# Altium schematic sheet HTBLEBMSALL4G&AB_Sch_V0.1_20260317.SchDoc
size A3; SheetNumber: 3; SheetTotal: 3
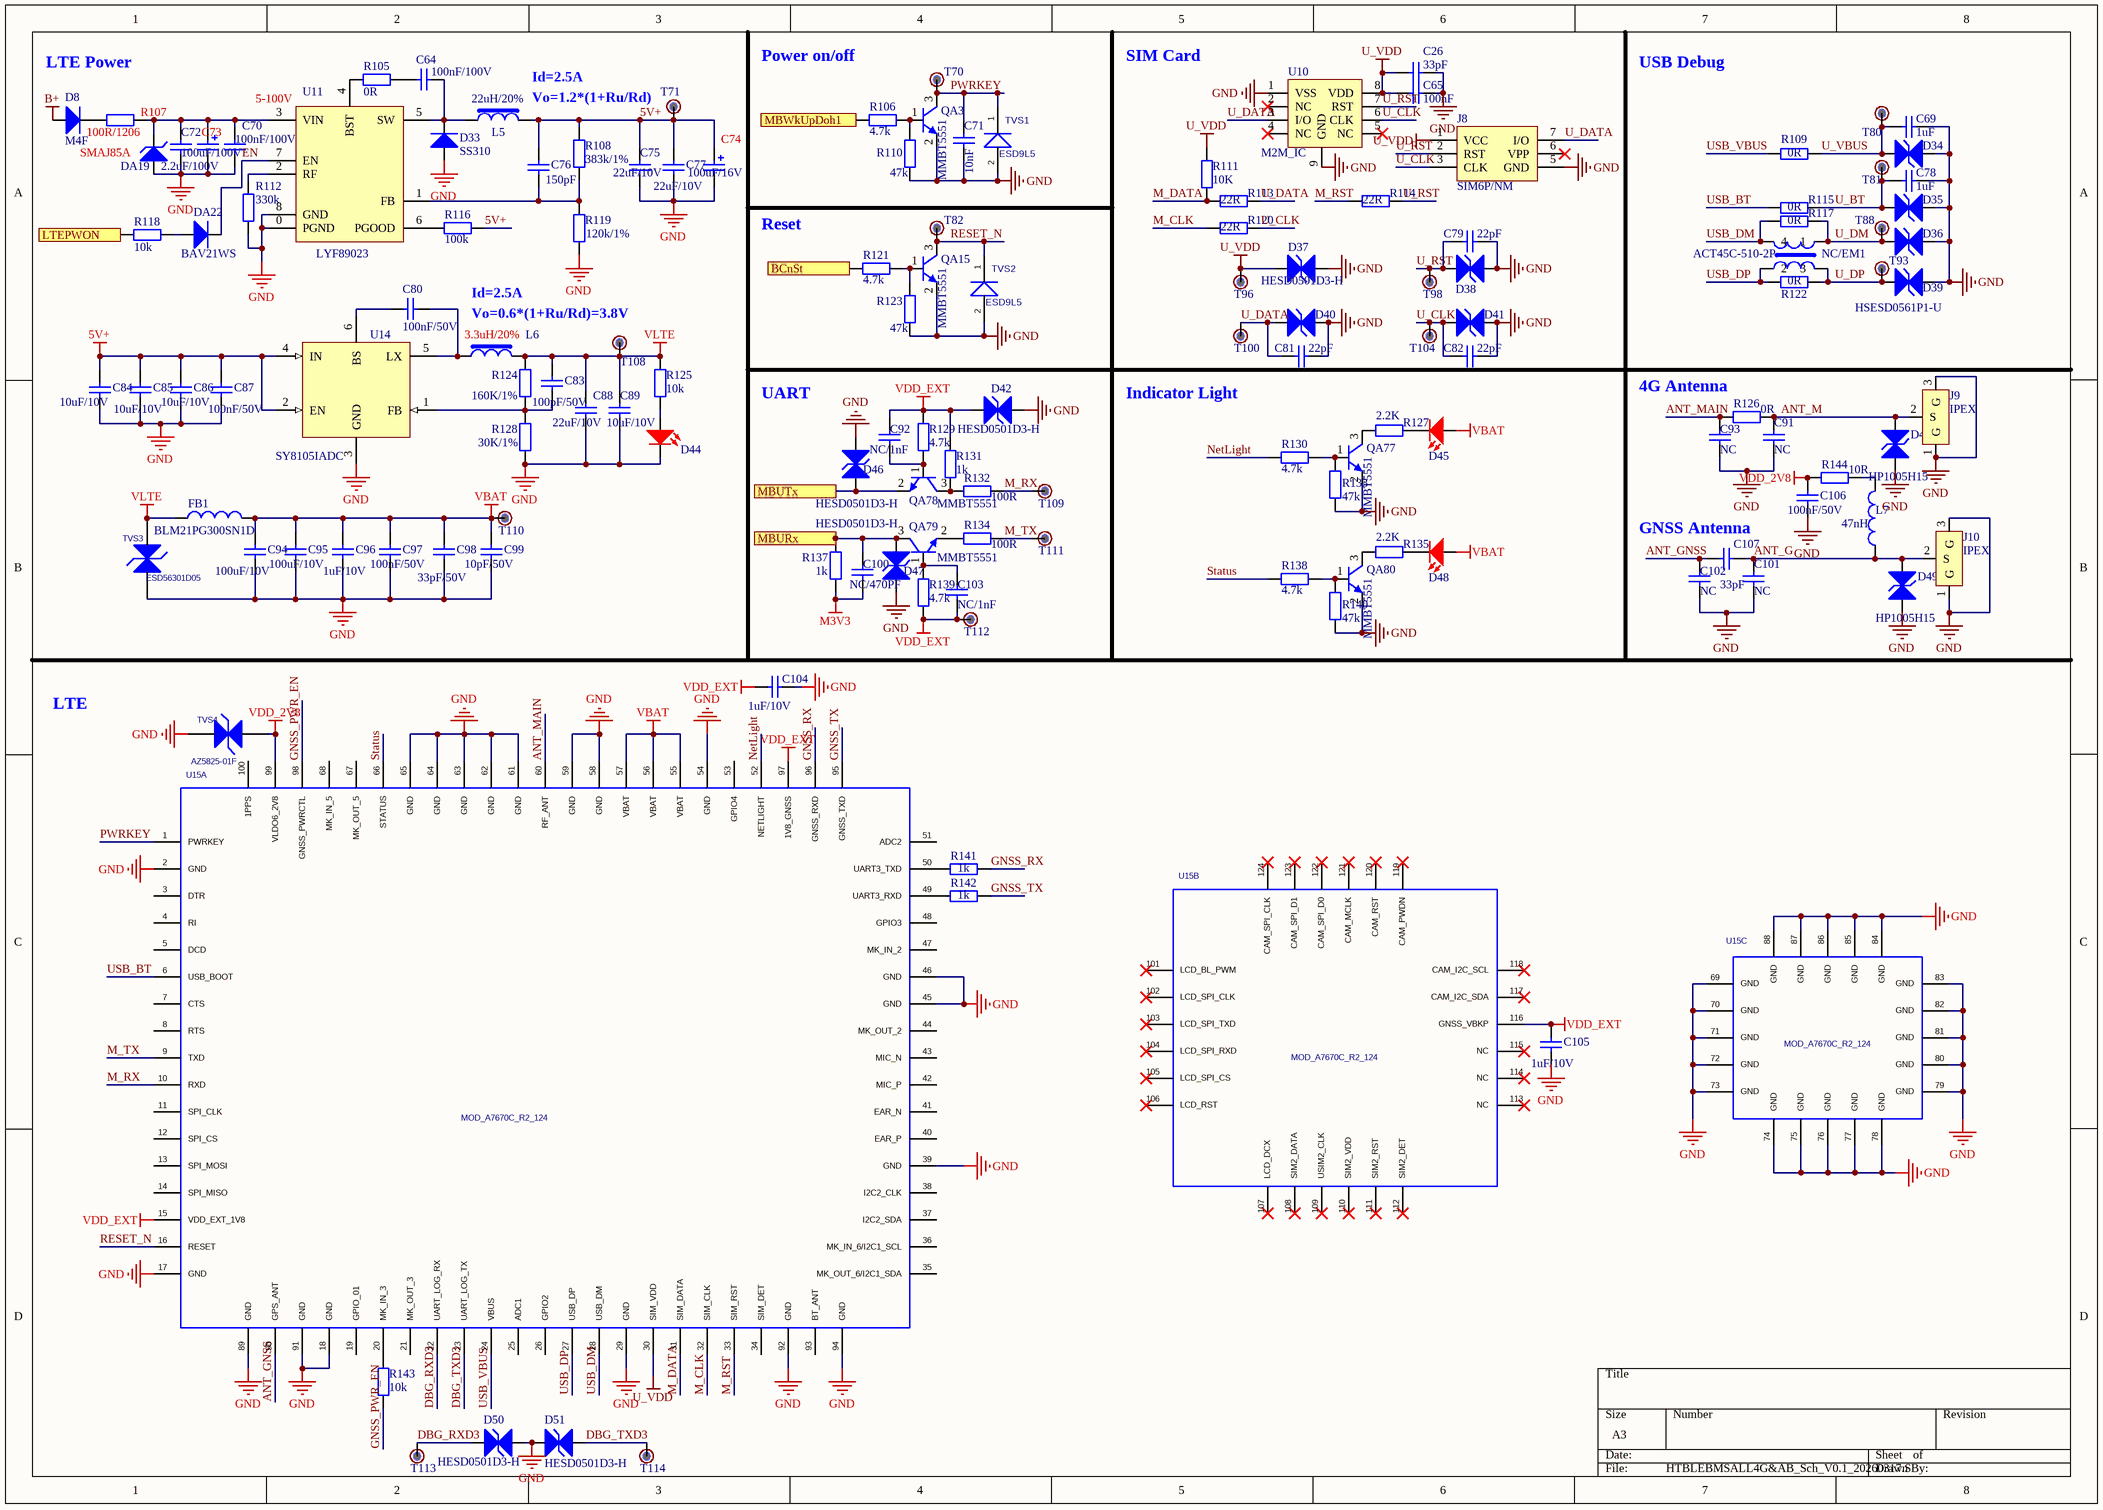
[diagram p0: HTBLEBMSALL4G&AB_Sch_V0.1_20260317.SchDoc]

## Parts
C26  33pF  [C0603]
C64  100nF/100V  [C0603]
C65  100nF  [C0603]
C69  1uF  [C0603]
C70  100nF/100V  [C0603]
C71  10nF  [C0603]
C72  2.2uF/100V  [C1206]
C73  value 100uF/100V  [CAP-SMD_BD12.5-L13.0-100UF100V]  (hidden comment: Cap Pol2)
C74  value 100uF/16V  [CAP-SMD_BD6.3-L5.7_100UF/16V]  (hidden comment: Cap Pol2)
C75  22uF/10V  [C0603]
C76  150pF  [C0603]
C77  22uF/10V  [C0603]
C78  1uF  [C0603]
C79  22pF  [C0603]
C80  100nF/50V  [C0603]
C81  22pF  [C0603]
C82  22pF  [C0603]
C83  100pF/50V  [C0603]
C84  10uF/10V  [C0603]
C85  10uF/10V  [C0603]
C86  10uF/10V  [C0603]
C87  100nF/50V  [C0603]
C88  22uF/10V  [C0603]
C89  10uF/10V  [C0603]
C91  NC  [C0603]
C92  NC/1nF  [C0603]
C93  NC  [C0603]
C94  100uF/10V  [C1206]
C95  100uF/10V  [C1206]
C96  1uF/10V  [C0603]
C97  100nF/50V  [C0603]
C98  33pF/50V  [C0603]
C99  10pF/50V  [C0603]
C100  NC/470PF  [C0603]
C101  NC  [C0603]
C102  NC  [C0603]
C103  NC/1nF  [C0603]
C104  1uF/10V  [C0603]
C105  1uF/10V  [C0603]
C106  100nF/50V  [C0603]
C107  33pF  [C0603]
D8  M4F  [SMAF/DO-214AD]
D33  SS310  [SMA/DO-214AC]
D34  HSESD0561P1-U  [SOD-323]  (value not drawn)
D35  HSESD0561P1-U  [SOD-323]  (value not drawn)
D36  HSESD0561P1-U  [SOD-323]  (value not drawn)
D37  HESD0501D3-H  [SOD-323]
D38  HESD0501D3-H  [SOD-323]  (value not drawn)
D39  HSESD0561P1-U  [SOD-323]
D40  HESD0501D3-H  [SOD-323]  (value not drawn)
D41  HESD0501D3-H  [SOD-323]  (value not drawn)
D42  HESD0501D3-H  [SOD-323]
D43  HP1005H15  [HP1005H15]
D44  XL-1608SURC-06/XL-1608UBC-04  [LED0603R]  (value not drawn)
D45  XL-1608SURC-06/XL-1608UBC-04  [LED0603R]  (value not drawn)
D46  HESD0501D3-H  [SOD-323]
D47  HESD0501D3-H  [SOD-323]
D48  XL-1608SURC-06/XL-1608UBC-04  [LED0603R]  (value not drawn)
D49  HP1005H15  [HP1005H15]
D50  HESD0501D3-H  [SOD-323]
D51  HESD0501D3-H  [SOD-323]
DA19  SMAJ85A  [SMA/DO-214AC]
DA22  BAV21WS  [SOD-323]
FB1  BLM21PG300SN1D  [0805]
J8  SIM6P/NM  [SIM6P]
J9  IPEX  [IPEX]
J10  IPEX  [IPEX]
L5  22uH/20%  [FXL0630-220]
L6  3.3uH/20%  [L4.0x4.0mm]
L7  47nH  [0402]
NC/EM1  ACT45C-510-2P  [WCM-4532]
QA3  MMBT5551  [SOT23]
QA15  MMBT5551  [SOT23]
QA77  MMBT5551  [SOT23]
QA78  MMBT5551  [SOT23]
QA79  MMBT5551  [SOT23]
QA80  MMBT5551  [SOT23]
R105  0R  [0603]
R106  4.7k  [0603]
R107  100R/1206  [1206]
R108  383k/1%  [0603]
R109  0R  [0603]
R110  47k  [0603]
R111  10K  [0603]
R112  330k  [0603]
R113  22R  [0603]
R114  22R  [0603]
R115  0R  [0603]
R116  100k  [0603]
R117  0R  [0603]
R118  10k  [0603]
R119  120k/1%  [0603]
R120  22R  [0603]
R121  4.7k  [0603]
R122  0R  [0603]
R123  47k  [0603]
R124  160K/1%  [0603]
R125  10k  [0603]
R126  0R  [0603]
R127  2.2K  [0603]
R128  30K/1%  [0603]
R129  4.7k  [0603]
R130  4.7k  [0603]
R131  1k  [0603]
R132  100R  [0603]
R133  47k  [0603]
R134  100R  [0603]
R135  2.2K  [0603]
R137  1k  [0603]
R138  4.7k  [0603]
R139  4.7k  [0603]
R140  47k  [0603]
R141  1k  [0603]
R142  1k  [0603]
R143  10k  [0603]
R144  10R  [0603]
T70  Test  [PT_STM]  (value not drawn)
T71  Test  [PT_STM]  (value not drawn)
T80  Test  [PT_STM]  (value not drawn)
T81  Test  [PT_STM]  (value not drawn)
T82  Test  [PT_STM]  (value not drawn)
T88  Test  [PT_STM]  (value not drawn)
T93  Test  [PT_STM]  (value not drawn)
T96  Test  [PT_STM]  (value not drawn)
T98  Test  [PT_STM]  (value not drawn)
T100  Test  [PT_STM]  (value not drawn)
T104  Test  [PT_STM]  (value not drawn)
T108  Test  [PT_STM]  (value not drawn)
T109  Test  [PT_STM]  (value not drawn)
T110  Test  [PT_STM]  (value not drawn)
T111  Test  [PT_STM]  (value not drawn)
T112  Test  [PT_STM]  (value not drawn)
T113  Test  [PT_STM]  (value not drawn)
T114  Test  [PT_STM]  (value not drawn)
TVS1  ESD9L5  [ESD9L5]
TVS2  ESD9L5  [ESD9L5]
TVS3  ESD56301D05  [DFN1610-2L]
TVS4  value AZ5825-01F  [DIO_DFN1006-2L_ESD5611N-2/TR_B_CH1]  (hidden comment: DIO_DFN1006-2L_ESD5611N-2/TR_B_CH1)
U10  M2M_IC  [SIM-IC]
U11  LYF89023  [ESOP8 - New]
U14  SY8105IADC  [SOT23-6]
U15  MOD_A7670C_R2_124  [MOD_A7670C_R2_124]  (parts A,B,C of 3)

## Ports
BCnSt (see HTBLEBMSALLCtrl_4G&AB_Sch_V0.1_260316[1C]), LTEPWON (see HTBLEBMSALLCtrl_4G&AB_Sch_V0.1_260316[1C]), MBURx (see HTBLEBMSALLCtrl_4G&AB_Sch_V0.1_260316[2C]), MBUTx (see HTBLEBMSALLCtrl_4G&AB_Sch_V0.1_260316[2C]), MBWkUpDoh1 (see HTBLEBMSALLCtrl_4G&AB_Sch_V0.1_260316[1C])

## Nets
5V+: C74.1 C75.2 C76.1 C77.2 C84.2 C85.2 C86.2 C87.2 L5.2 R108.1 R116.1 T71.1 U14.2(EN) U14.4(IN)
B+: D8.1(A)
GND: C26.2 C65.2 C69.1 C70.1 C71.1 C72.1 C73.2 C74.2 C75.1 C77.1 C78.1 C79.2 C81.2 C82.2 C84.1 C85.1 C86.1 C87.1 C88.1 C89.1 C91.1 C93.1 C94.1 C95.1 C96.1 C97.1 C98.1 C99.1 C101.1 C102.1 C104.1 C105.1 C106.1 D33.1(A) D34.1(A) D35.1(A) D36.1(A) D37.1(A) D38.1(A) D39.1(A) D40.1(A) D41.1(A) D42.1(A) D43.1(A) D44.2(K) D46.1(A) D47.2(K) D49.1(A) D50.2(K) D51.1(A) DA19.1(A) J8.5(GND) J9.1(G) J9.3(G) J10.1(G) J10.3(G) QA3.2(E) QA15.2(E) QA77.2(E) QA80.2(E) R110.1 R112.1 R119.2 R123.1 R128.1 R133.1 R140.1 TVS1.2 TVS2.2 TVS3.2 TVS4.1 U10.1(VSS) U10.9(GND) U11.0(PGND) U11.8(GND) U14.3(GND) U15.2(GND) U15.17(GND) U15.18(GND) U15.29(GND) U15.39(GND) U15.45(GND) U15.46(GND) U15.54(GND) U15.58(GND) U15.59(GND) U15.61(GND) U15.62(GND) U15.63(GND) U15.64(GND) U15.65(GND) U15.69(GND) U15.70(GND) U15.71(GND) U15.72(GND) U15.73(GND) U15.74(GND) U15.75(GND) U15.76(GND) U15.77(GND) U15.78(GND) U15.79(GND) U15.80(GND) U15.81(GND) U15.82(GND) U15.83(GND) U15.84(GND) U15.85(GND) U15.86(GND) U15.87(GND) U15.88(GND) U15.89(GND) U15.91(GND) U15.92(GND) U15.94(GND)
M3V3: C100.2 R137.2
U_VDD: C26.1 C65.1 D37.2(K) J8.1(VCC) R111.1 T96.1 U10.8(VDD) U15.30(SIM_VDD)
VBAT: C94.2 C95.2 C96.2 C97.2 C98.2 C99.2 D45.1(A) D48.1(A) FB1.2 T110.1 U15.55(VBAT) U15.56(VBAT) U15.57(VBAT)
VDD_2V8: C106.2 R144.1 TVS4.2 U15.99(VLDO6_2V8)
VDD_EXT: C92.2 C103.2 C104.2 C105.2 D42.2(K) R129.2 R131.1 R139.2 T112.1 U15.15(VDD_EXT_1V8) U15.97(1V8_GNSS) U15.116(GNSS_VBKP)
VLTE: C83.1 C88.2 C89.2 FB1.1 L6.2 R124.2 R125.1 T108.1 TVS3.1
ANT_G: C101.2 C107.1 D49.2(K) J10.2(S) L7.1
ANT_GNSS: C102.2 C107.2 U15.90(GPS_ANT)
ANT_M: C91.2 D43.2(K) J9.2(S) R126.2
ANT_MAIN: C93.2 R126.1 U15.60(RF_ANT)
BCnSt: R121.1 ; port BCnSt
DBG_RXD3: D50.1(A) T113.1 U15.22(UART_LOG_RX)
DBG_TXD3: D51.2(K) T114.1 U15.23(UART_LOG_TX)
EN: DA22.2(K) U11.7(EN)
GNSS_PWR_EN: R143.1 U15.98(GNSS_PWRCTL)
GNSS_RX: R141.2 U15.96(GNSS_RXD)
GNSS_TX: R142.2 U15.95(GNSS_TXD)
LTEPWON: R118.1 ; port LTEPWON
M_CLK: R120.2 U15.32(SIM_CLK)
M_DATA: R111.2 R113.2 U15.31(SIM_DATA)
M_RST: R114.2 U15.33(SIM_RST)
M_RX: R132.2 T109.1 U15.10(RXD)
M_TX: R134.2 T111.1 U15.9(TXD)
MBURx: C100.1 D47.1(A) QA79.3(C) R137.1 ; port MBURx
MBUTx: D46.2(K) QA78.2(E) ; port MBUTx
MBWkUpDoh1: R106.1 ; port MBWkUpDoh1
NetLight: R130.1 U15.52(NETLIGHT)
PWRKEY: C71.2 QA3.3(C) T70.1 TVS1.1 U15.1(PWRKEY)
RESET_N: QA15.3(C) T82.1 TVS2.1 U15.16(RESET)
Status: R138.1 U15.66(STATUS)
U_BT: C78.2 D35.2(K) R115.2 T81.1
U_CLK: C82.1 D41.2(K) J8.3(CLK) R120.1 T104.1 U10.6(CLK)
U_DATA: C81.1 D40.2(K) J8.7(I/O) R113.1 T100.1 U10.3(I/O)
U_DM: D36.2(K) NC/EM1.1 R117.2 T88.1
U_DP: D39.2(K) NC/EM1.3 R122.2 T93.1
U_RST: C79.1 D38.2(K) J8.2(RST) R114.1 T98.1 U10.7(RST)
U_VBUS: C69.2 D34.2(K) R109.2 T80.1
USB_BT: R115.1 U15.6(USB_BOOT)
USB_DM: NC/EM1.4 R117.1 U15.28(USB_DM)
USB_DP: NC/EM1.2 R122.1 U15.27(USB_DP)
USB_VBUS: R109.1 U15.24(VBUS)
NetC64_1: C64.1 D33.2(K) L5.1 U11.5(SW)
NetC64_2: C64.2 R105.1
NetC70_2: C70.2 C72.2 C73.1 DA19.2(K) R107.1 U11.3(VIN)
NetC76_2: C76.2 R108.2 R119.1 U11.1(FB)
NetC80_1: C80.1 L6.1 U14.5(LX)
NetC80_2: C80.2 U14.6(BS)
NetC83_2: C83.2 R124.1 R128.2 U14.1(FB)
NetC92_1: C92.1 QA78.1(B) R129.1
NetC103_1: C103.1 QA79.1(B) R139.1
NetD8_2: D8.2(K) R107.2
NetD44_1: D44.1(A) R125.2
NetD45_2: D45.2(K) R127.1
NetD48_2: D48.2(K) R135.1
NetDA22_1: DA22.1(A) R118.2
NetL7_2: L7.2 R144.2
NetQA3_1: QA3.1(B) R106.2 R110.2
NetQA15_1: QA15.1(B) R121.2 R123.2
NetQA77_1: QA77.1(B) R130.2 R133.2
NetQA77_3: QA77.3(C) R127.2
NetQA78_3: QA78.3(C) R131.2 R132.1
NetQA79_2: QA79.2(E) R134.1
NetQA80_1: QA80.1(B) R138.2 R140.2
NetQA80_3: QA80.3(C) R135.2
NetR105_2: R105.2 U11.4(BST)
NetR112_2: R112.2 U11.2(RF)
NetR116_2: R116.2 U11.6(PGOOD)
NetR141_1: R141.1 U15.50(UART3_TXD)
NetR142_1: R142.1 U15.49(UART3_RXD)
NetR143_2: R143.2 U15.20(MK_IN_3)

Not connected (* = marked no-connect by the designer): J8 6(VPP)*; U10 2(NC)* 4(NC)* 5(NC)*; U15 3(DTR) 4(RI) 5(DCD) 7(CTS) 8(RTS) 11(SPI_CLK) 12(SPI_CS) 13(SPI_MOSI) 14(SPI_MISO) 19(GPIO_01) 21(MK_OUT_3) 25(ADC1) 26(GPIO2) 34(SIM_DET) 35(MK_OUT_6/I2C1_SDA) 36(MK_IN_6/I2C1_SCL) 37(I2C2_SDA) 38(I2C2_CLK) 40(EAR_P) 41(EAR_N) 42(MIC_P) 43(MIC_N) 44(MK_OUT_2) 47(MK_IN_2) 48(GPIO3) 51(ADC2) 53(GPIO4) 67(MK_OUT_5) 68(MK_IN_5) 93(BT_ANT) 100(1PPS) 101(LCD_BL_PWM)* 102(LCD_SPI_CLK)* 103(LCD_SPI_TXD)* 104(LCD_SPI_RXD)* 105(LCD_SPI_CS)* 106(LCD_RST)* 107(LCD_DCX)* 108(SIM2_DATA)* 109(USIM2_CLK)* 110(SIM2_VDD)* 111(SIM2_RST)* 112(SIM2_DET)* 113(NC)* 114(NC)* 115(NC)* 117(CAM_I2C_SDA)* 118(CAM_I2C_SCL)* 119(CAM_PWDN)* 120(CAM_RST)* 121(CAM_MCLK)* 122(CAM_SPI_D0)* 123(CAM_SPI_D1)* 124(CAM_SPI_CLK)*

## Notes on the sheet
- LTE Power
- (near U11) 5-100V
- Vo=1.2*(1+Ru/Rd)
- Id=2.5A
- Power on/off
- SIM Card
- USB Debug
- Reset
- Vo=0.6*(1+Ru/Rd)=3.8V
- UART
- Indicator Light
- 4G Antenna
- GNSS Antenna
- LTE

## Library data of the parts
C26 C64 C65 C69-C72 C75-C89 C91-C107 = Cap: Capacitor
C73 C74 = Cap Pol2: Polarized Capacitor (Axial); Published: 8-Jun-2000; LatestRevisionDate: 17-Jul-2002; LatestRevisionNote: Re-released for DXP Platform.; PackageReference: POLAR0.8; Publisher: Altium Limited; PackageDescription: Polarized Capacitor; 2 Leads
D8 D33 DA22 = Diode
D34-D43 D46 D47 D49-D51 = D TVS: TVS Diode, bidirectional
D44 D45 D48 = LEDR: Red LED
DA19 = Diode TVS: Uniderection TVS Diode
FB1 L7 = Inductor: Code_IEC: 1005; Published: 8-Jun-2000; LatestRevisionDate: 29-May-2009; LatestRevisionNote: IPC-7351 Footprint Added.; PackageReference: 0402-A; Publisher: Altium Limited; PackageDescription: Chip Inductor; Code_JEITA: 0402
  FB1: Value: BLM21PG300SN1D
J8 = SIM6P: NANO SIM 6Pin
J9 J10 = IPEX: NANO SIM 6Pin
L5 L6 = Inductor2: SMD  6.6*7.0*2.8
NC/EM1 = ACT45B: EMC Components; Value: ACT45C-510-2P
QA3 QA15 QA77-QA80 = S8050LT1: NPN Transistor
R105-R135 R137-R144 = Res2: Resistor
T70 T71 T80-T82 T88 T93 T96 T98 T100 T104 T108-T114 = TESTPOINT1
TVS1 TVS2 = ESD9L5: TVS 5V 2.5PF SOD-923 RO; Manufacturer: Infineon; Part Number1: S00013500015; Geometry.Height: 0.55mm; Value: ESD9M5.0ST5G; Vendor1: toshiba; Vendor2 P/N: DF2S6.8UFS; Vendor3 P/N: ESD9L5.0ST5G; Vendor1 P/N: ESD9M5.0ST5G; PCB DECAL: ESD9L5; Part Number2: S00013500052; Vendor2: toshiba; Part Number3: S00013500009
TVS3 = DIO_DFN1006-2L_ESD5611N-2/TR_B_CH1: PART Number1: SX0151000111; Geometry.Height: 0.53mm; Vendor1: 韦尔半导体; Value: AZ5825-01F; Decal: DIO_DFN1006-2L_ESD5611N-2/TR_B_CH1; Vendor1 P/N: ESD5611N-2/TR_B_CH1; PCB DECAL: DIO_DFN1006-2L_ESD5611N-2/TR_B_CH1
TVS4 = DIO_DFN1006-2L_ESD5611N-2/TR_B_CH1: BI-TVS 5V 50PF DFN1006-2L RO; PART Number1: SX0151000111; Geometry.Height: 0.53mm; Vendor1: 韦尔半导体; Decal: DIO_DFN1006-2L_ESD5611N-2/TR_B_CH1; Vendor1 P/N: ESD5611N-2/TR_B_CH1; PCB DECAL: DIO_DFN1006-2L_ESD5611N-2/TR_B_CH1
U11 = LYF89023: 100V 2.5A DCDC
U14 = SY8105I: High efficiency, 500kHz, 4.5-18V input, 5A synchronous step-down regulator
U15 = MOD_A7670C_R2_124: 8BAE00-A7670C_R2 _V1.01; Vendor1 P/N: S2-109SD; Vendor: SIMCOM; Geometry.Height: 2.5 mm; Part Number1: S2-109SD; Decal: MOD_A7670C_R2_124; PCB DECAL: MOD_A7670C_R2_124